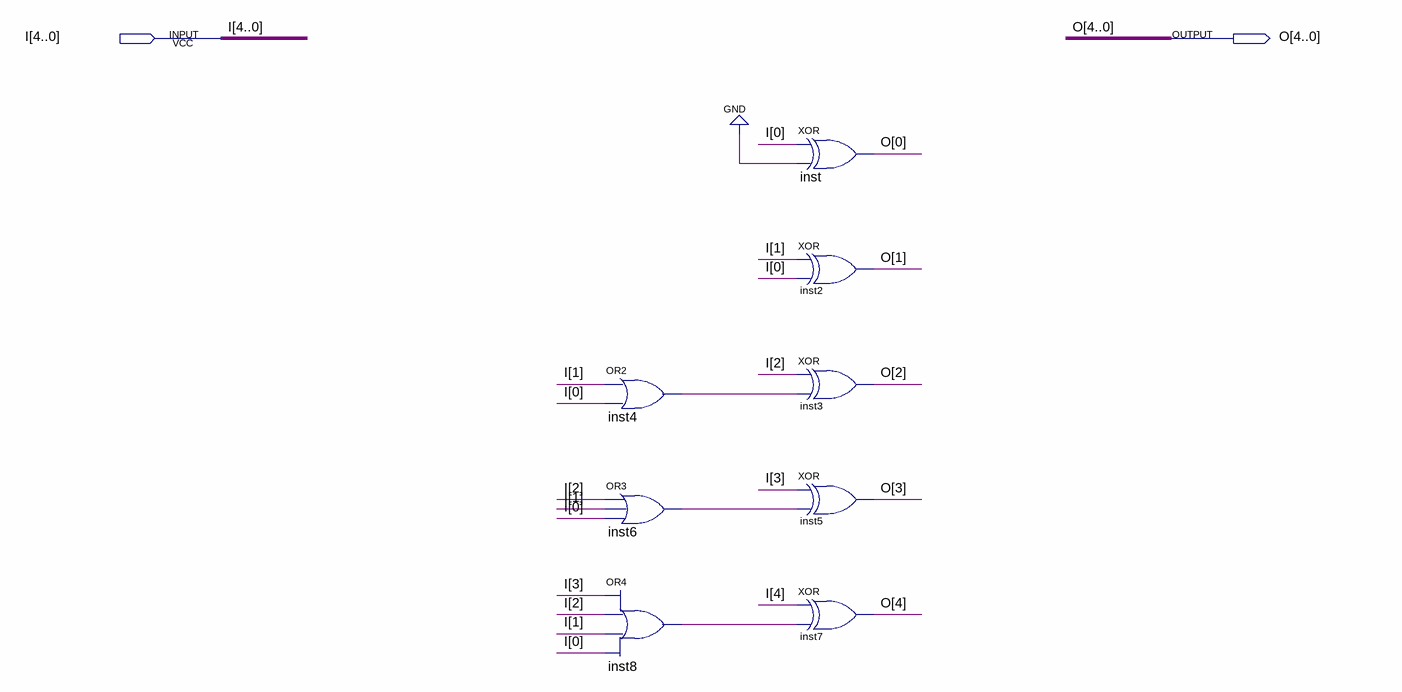
[diagram p0: schematic sheet]
// Quartus schematic inversor5.bdf as structural Verilog: 8 symbols, 2 pins
module inversor5 (
  input  [4:0] I,
  output [4:0] O
);

  wire inst4_out, inst6_out, inst8_out;

  or inst4 (inst4_out, I[1], I[0]);
  or inst6 (inst6_out, I[2], I[1], I[0]);
  or inst8 (inst8_out, I[3], I[2], I[1], I[0]);
  xor inst (O[0], I[0], 1'b0);
  xor inst2 (O[1], I[1], I[0]);
  xor inst3 (O[2], I[2], inst4_out);
  xor inst5 (O[3], I[3], inst6_out);
  xor inst7 (O[4], I[4], inst8_out);
endmodule
